# EAGLE design RH040.2 (EAGLE 7.1.0)
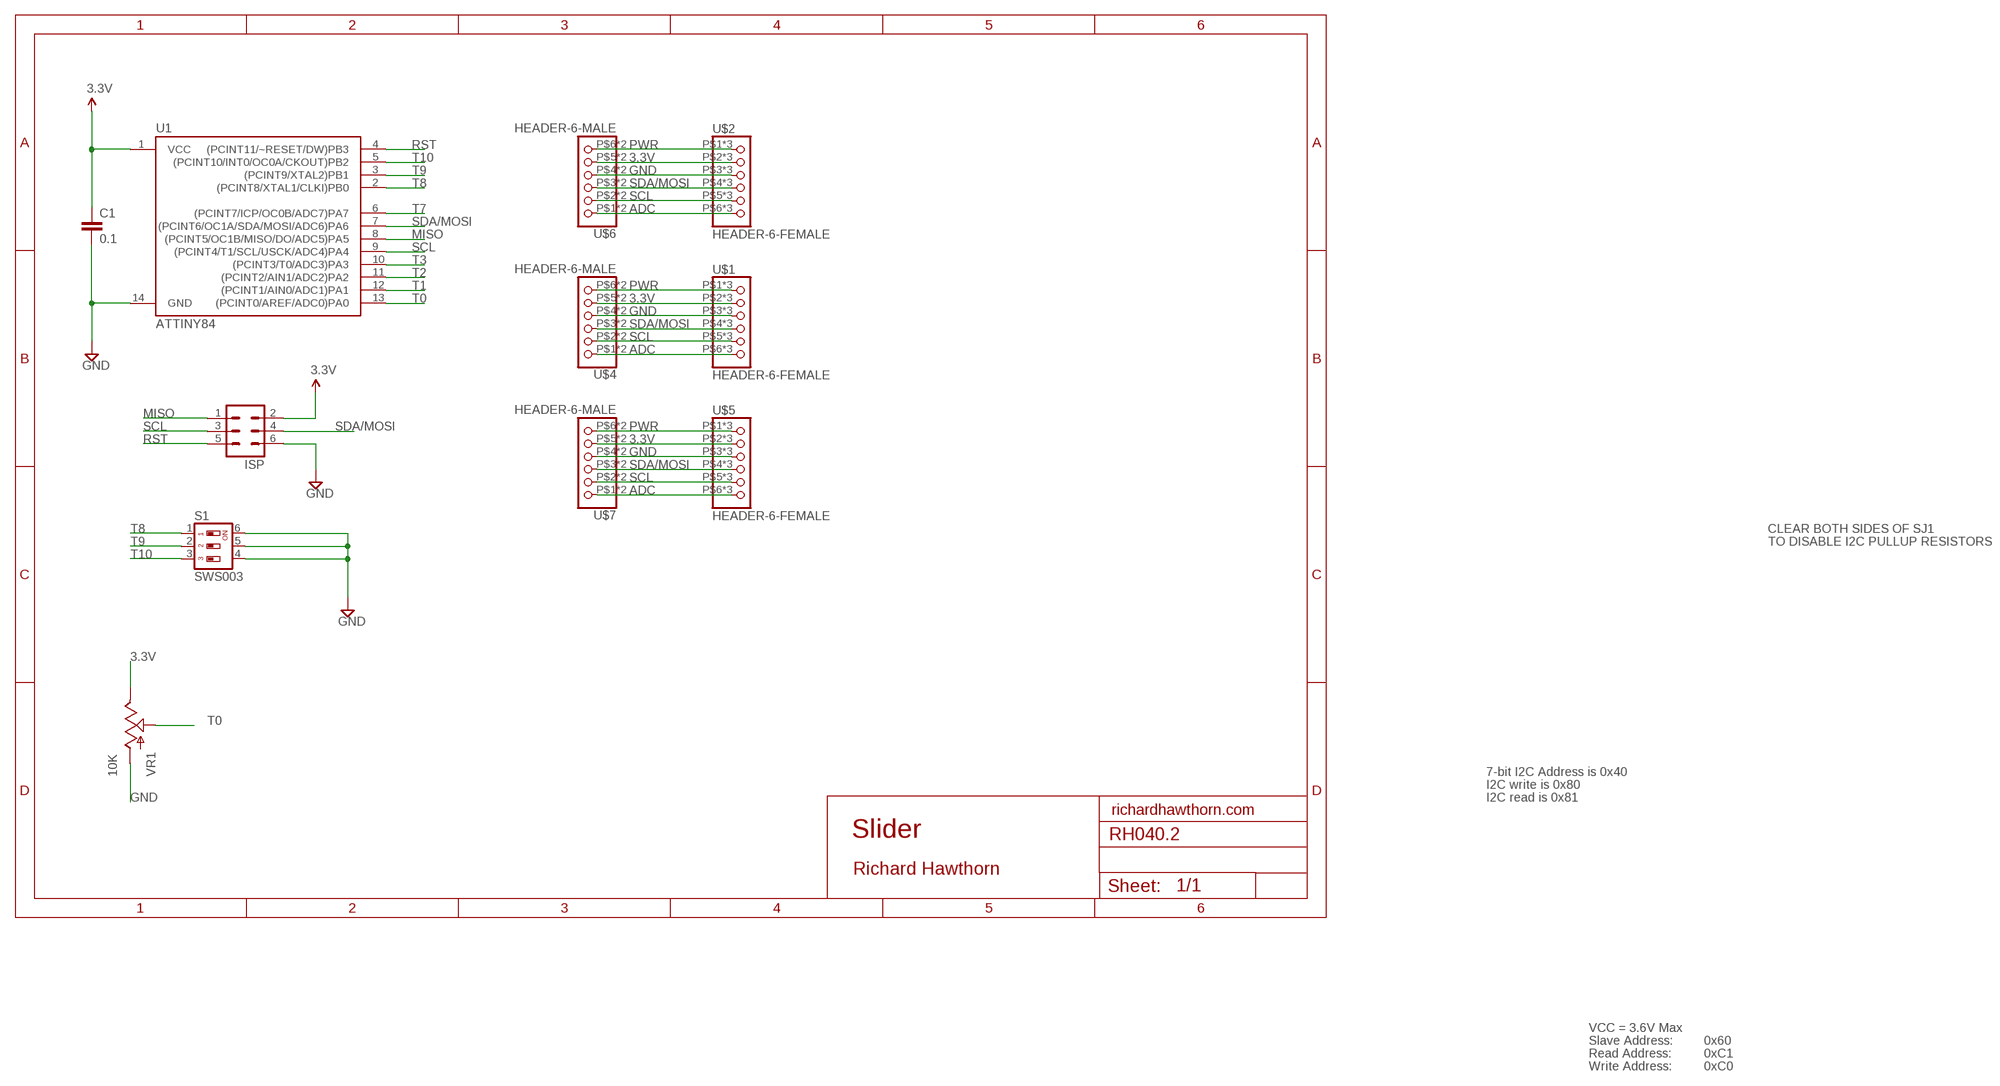
[diagram p0: schematic, sheet 1]

## Parts
C1  0.1  CAP0603-CAP  [0603-CAP]
ISP  MA03-2  [MA03-2]
S1  SWS003  [SMS-003]
U1  ATTINY84  [SO14]
U$1  HEADER-6-FEMALE  [2MMHEADER6]
U$2  HEADER-6-FEMALE  [2MMHEADER6]
U$4  HEADER-6-MALE  [2MMHEADERPIN6]
U$5  HEADER-6-FEMALE  [2MMHEADER6]
U$6  HEADER-6-MALE  [2MMHEADERPIN6]
U$7  HEADER-6-MALE  [2MMHEADERPIN6]
VR1  10K  SLIDER30MM-KIT  [SLIDER-MEDIUM-KIT]

## Nets
3.3V: C1.1 ISP.2 U1.1(VCC) U$1.P$2 U$1.P$10 U$1.P$18 U$2.P$2 U$2.P$10 U$2.P$18 U$4.P$5 U$4.P$13 U$5.P$2 U$5.P$10 U$5.P$18 U$6.P$5 U$6.P$13 U$7.P$5 U$7.P$13 VR1.TOP(E)
ADC: U$1.P$6 U$1.P$14 U$1.P$22 U$2.P$6 U$2.P$14 U$2.P$22 U$4.P$1 U$4.P$9 U$5.P$6 U$5.P$14 U$5.P$22 U$6.P$1 U$6.P$9 U$7.P$1 U$7.P$9
GND [power]: C1.2 ISP.6 S1.4 S1.5 S1.6 U1.14(GND) U$1.P$3 U$1.P$11 U$1.P$19 U$2.P$3 U$2.P$11 U$2.P$19 U$4.P$4 U$4.P$12 U$5.P$3 U$5.P$11 U$5.P$19 U$6.P$4 U$6.P$12 U$7.P$4 U$7.P$12 VR1.BOTTOM(A)
MISO: ISP.1 U1.8((PCINT5/OC1B/MISO/DO/ADC5)PA5)
PWR [power]: U$1.P$1 U$1.P$9 U$1.P$17 U$2.P$1 U$2.P$9 U$2.P$17 U$4.P$6 U$4.P$14 U$5.P$1 U$5.P$9 U$5.P$17 U$6.P$6 U$6.P$14 U$7.P$6 U$7.P$14
RST: ISP.5 U1.4((PCINT11/~RESET/DW)PB3)
SCL: ISP.3 U1.9((PCINT4/T1/SCL/USCK/ADC4)PA4) U$1.P$5 U$1.P$13 U$1.P$21 U$2.P$5 U$2.P$13 U$2.P$21 U$4.P$2 U$4.P$10 U$5.P$5 U$5.P$13 U$5.P$21 U$6.P$2 U$6.P$10 U$7.P$2 U$7.P$10
SDA/MOSI: ISP.4 U1.7((PCINT6/OC1A/SDA/MOSI/ADC6)PA6) U$1.P$4 U$1.P$12 U$1.P$20 U$2.P$4 U$2.P$12 U$2.P$20 U$4.P$3 U$4.P$11 U$5.P$4 U$5.P$12 U$5.P$20 U$6.P$3 U$6.P$11 U$7.P$3 U$7.P$11
T0: U1.13((PCINT0/AREF/ADC0)PA0) VR1.WIPER(S)
T1: U1.12((PCINT1/AIN0/ADC1)PA1)
T2: U1.11((PCINT2/AIN1/ADC2)PA2)
T3: U1.10((PCINT3/T0/ADC3)PA3)
T7: U1.6((PCINT7/ICP/OC0B/ADC7)PA7)
T8: S1.1 U1.2((PCINT8/XTAL1/CLKI)PB0)
T9: S1.2 U1.3((PCINT9/XTAL2)PB1)
T10: S1.3 U1.5((PCINT10/INT0/OC0A/CKOUT)PB2)

## Notes on the sheet
- CLEAR BOTH SIDES OF SJ1
- TO DISABLE I2C PULLUP RESISTORS
- 7-bit I2C Address is 0x40
- I2C write is 0x80
- I2C read is 0x81
- richardhawthorn.com
- Slider
- Richard Hawthorn
- VCC = 3.6V Max
- Slave Address: | 0x60
- Read Address: | 0xC1
- Write Address: | 0xC0

## Library data of the parts
C1 = LowPowerLab:CAP: Capacitor Standard 0603 ceramic capacitor, and 0.1" leaded capacitor.
ISP = Richards:MA03-2: PIN HEADER; OC_FARNELL: unknown; OC_NEWARK: unknown
S1 = smd-special:SWS003: SMD Dip Switch 3 pol.
U1 = SparkFun-DigitalIC:ATTINY84: Atmel 14-pin 2/4/8kB flash uC
U$1 U$2 U$5 = Richards:HEADER-6-FEMALE
U$4 U$6 U$7 = Richards:HEADER-6-MALE
VR1 = SparkFun-Electromechanical:SLIDER: Slide-type potentiometers. Small and meduim footprints untested.; PROD_ID: RES-11931

## Net classes
1 power: width 0.381 mm, clearance 0.254 mm

## Board
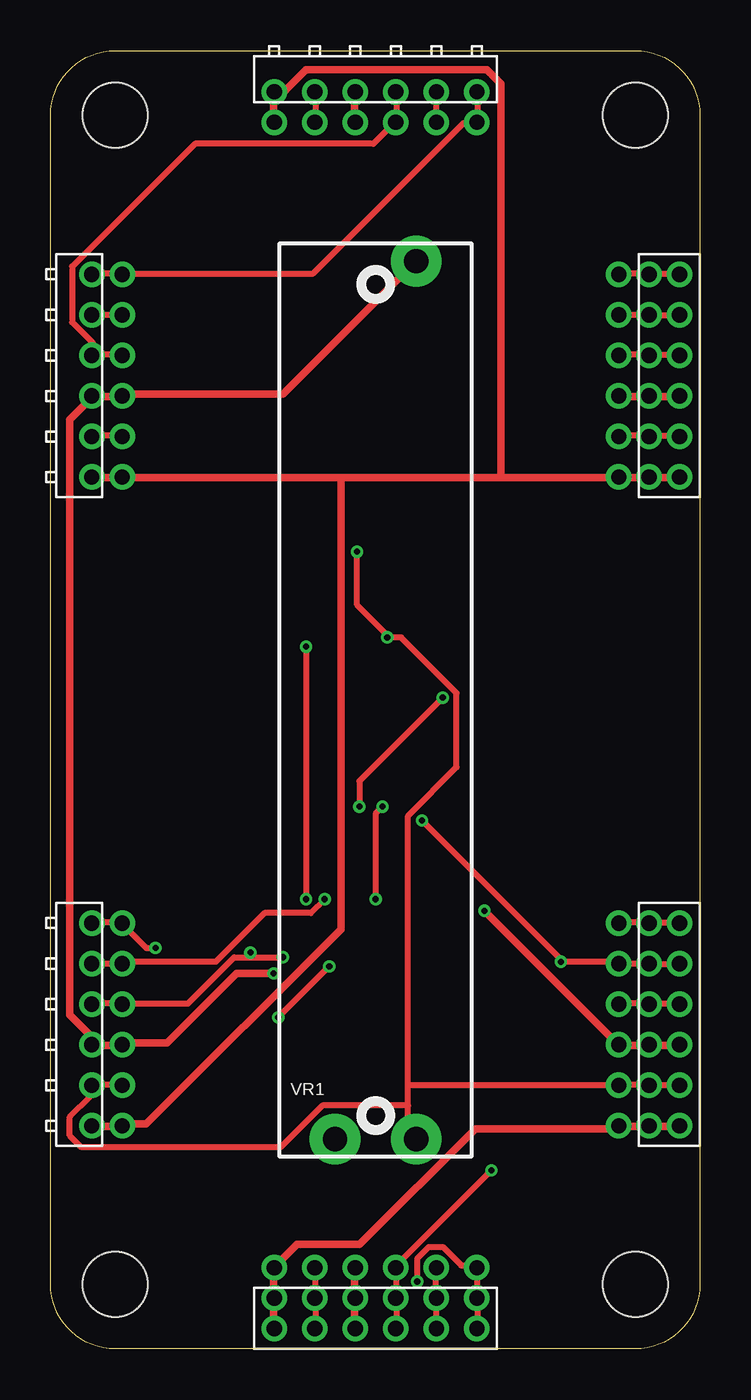
[diagram p1: board, top side]
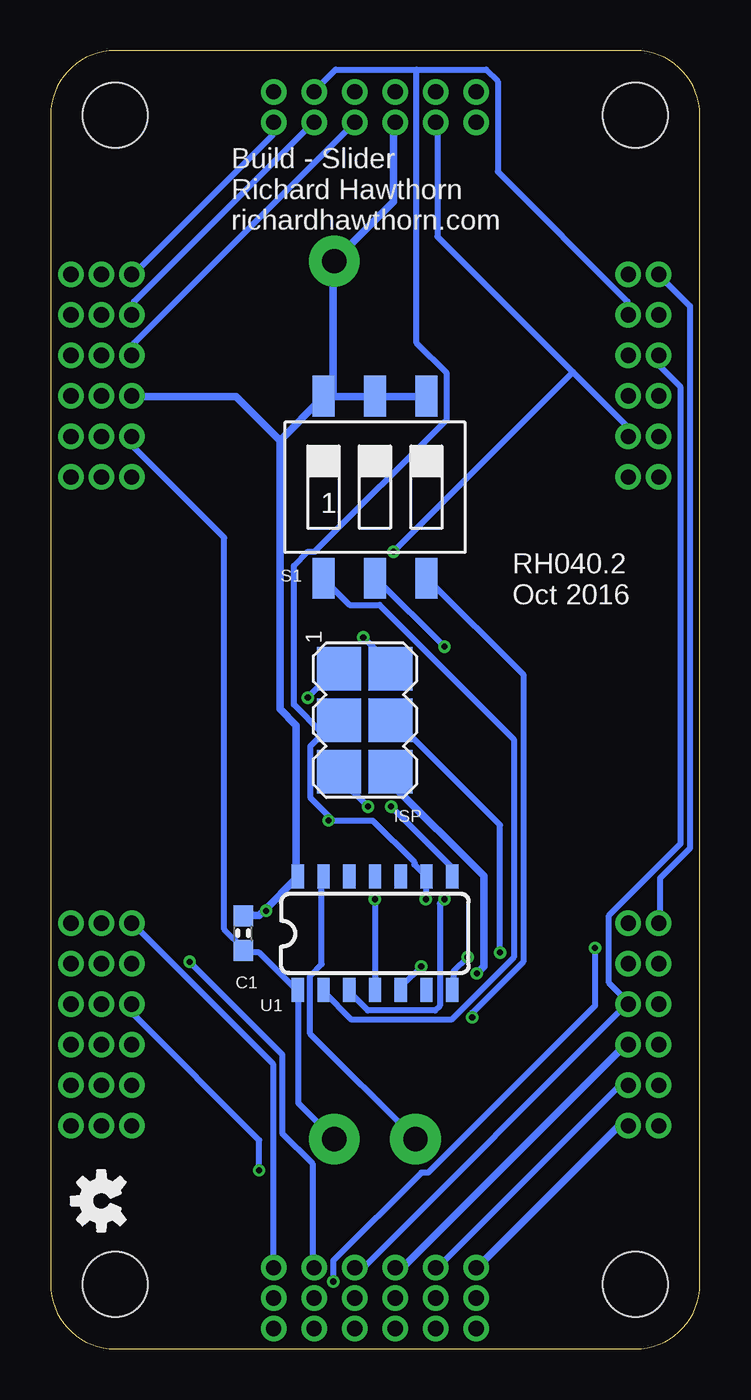
[diagram p2: board, bottom side, seen from below]

Size 32.03 x 64.03 mm. Coordinates in mm from the lower left corner, seen from the top.
Outline: 28.86,0 3.17,0 arc-90 0,3.17 0,60.85 arc-90 3.17,64.03 28.86,64.03 arc-90 32.03,60.85 32.03,3.17 arc-90 28.86,0
Copper layers (1*16): Top 0.035mm / dielectric 1.5mm / Bottom 0.035mm
Design rules "ITEADstudio_DRC *": minimum track width 12mil, minimum drill 12mil, track to track 6mil, track to pad 6mil, pad to pad 6mil, via to via 6mil, smd to smd 0mil, copper to edge 10mil, drill to drill 10mil, minimum pad ring 10mil, minimum via ring 6mil, stop-mask expansion 2mil, vias tented up to drill 100mil, thermal gap 15mil
Holes 3.2 mm at 28.86,3.17 28.86,60.85 3.17,3.17 3.17,60.85
tRestrict: area 26.3,0 to 32,5.7; area 26.3,58.3 to 32,64; area 0,58.3 to 5.7,64; area 0,0 to 5.7,5.7
bRestrict: area 0,0 to 5.7,5.7; area 0,58.3 to 5.7,64; area 26.3,58.3 to 32,64; area 26.3,0 to 32,5.7

### Footprints (pad centres in the part's own frame; a part is rotated, then mirrored left to right if it is on the bottom)
0603-CAP = smd 1.016 x 0.965: 1 -0.85,0; 2 0.85,0
MA03-2 = smd 2.159 x 2.159: 1 -2.54,-1.27; 2 -2.54,1.27; 3 0,-1.27; 4 0,1.27; 5 2.54,-1.27; 6 2.54,1.27
SMS-003 = smd 1.092 x 2.007: 1 -2.54,-4.496; 2 0,-4.496; 3 2.54,-4.496; 4 2.54,4.496; 5 0,4.496; 6 -2.54,4.496
SO14 = smd 0.6 x 1.2: 1 -3.81,-2.8; 2 -2.54,-2.8; 3 -1.27,-2.8; 4 0,-2.8; 5 1.27,-2.8; 6 2.54,-2.8; 7 3.81,-2.8; 8 3.81,2.8; 9 2.54,2.8; 10 1.27,2.8; 11 0,2.8; 12 -1.27,2.8; 13 -2.54,2.8; 14 -3.81,2.8
2MMHEADER6 = drill 0.75: P$1 1,5; P$2 1,3; P$3 1,1; P$4 1,-1; P$5 1,-3; P$6 1,-5; P$9 -0.5,5; P$10 -0.5,3; P$11 -0.5,1; P$12 -0.5,-1; P$13 -0.5,-3; P$14 -0.5,-5; P$17 -2,5; P$18 -2,3; P$19 -2,1; P$20 -2,-1; P$21 -2,-3; P$22 -2,-5
2MMHEADERPIN6 = drill 0.75: P$1 1,5; P$2 1,3; P$3 1,1; P$4 1,-1; P$5 1,-3; P$6 1,-5; P$9 -0.5,5; P$10 -0.5,3; P$11 -0.5,1; P$12 -0.5,-1; P$13 -0.5,-3; P$14 -0.5,-5
SLIDER-MEDIUM-KIT = drill 1.2 pad 2.5: BOTTOM 21.65,-2; TOP -21.65,-2; WIPER -21.65,2

### Placement (x,y rotation side)
C1  22.53,20.5 90 bottom
ISP  16.53,31 270 bottom
S1  16.03,42.5 0 bottom
U1  16.03,20.5 0 bottom
U$1  29.03,16 180 top
U$2  16.03,3 90 top
U$3  [OSHW-LOGO-S]  29.53,7.3 90 bottom
U$4  2.53,48 0 top
U$5  29.03,48 180 top
U$6  2.53,16 0 top
U$7  16.03,61.5 270 top
VR1  16.03,32 90 top

### Tracks (layer width: path | path; a pad name or v marks a point on that pad's centre or on a via)
3.3V  (via drill 0.3)
  Top 0.305: U$4.P$13 2.09,45.03 3.46,45.03 U$4.P$5 | U$7.P$5 13.06,60.58 13.06,61.95 U$7.P$13 | U$6.P$5 3.46,13.03 2.09,13.03 U$6.P$13 1.97,12.92 1.97,12.46 0.94,11.43 0.94,10.52 1.52,9.94 11.35,9.94 13.4,12 17.63,12 | U$2.P$18 13.06,1.03 13.06,2.4 U$2.P$10 13.06,2.63 13.06,3.89 U$2.P$2 | U$5.P$2 28.03,45.03 29.52,45.03 U$5.P$10 29.63,45.03 31.01,45.03 U$5.P$18 | U$1.P$18 31.01,13.03 29.63,13.03 U$1.P$10 29.52,13.03 28.03,13.03 U$1.P$2 27.92,13.03 17.63,13.03 | 17.63,12 17.63,10.74 17.98,10.4 VR1.TOP | 17.63,12 17.63,13.03 | 17.63,13.03 17.63,26.29 20.03,28.69 20.03,32.35 17.29,35.09 v16.6,35.09 16.6,35.2 15.12,36.69 v15.12,39.32
  Bottom 0.305: 6.26,48.18 12.95,54.86 12.95,60.47 U$7.P$5 | 6.26,48.18 3.57,45.49 3.57,45.03 U$4.P$5 | U$6.P$5 3.57,12.92 4.03,12.92 12.95,4 U$2.P$2 | v16.6,35.09 15.35,33.83 15.35,33.6 ISP.2 | VR1.TOP 18.09,10.4 19.8,12.12 19.8,17.6 U1.1 19.92,17.72 21.75,19.55 22.43,19.55 C1.1 22.55,19.77 23.46,20.69 23.46,40.01 27.92,44.46 27.92,44.92 U$5.P$2 | v15.12,39.32 6.26,48.18
ADC  (via drill 0.3)
  Top 0.305: U$2.P$22 21.06,1.03 21.06,2.4 U$2.P$14 21.06,2.63 21.06,3.89 U$2.P$6 20.95,4.12 20.26,4.12 19.35,5.03 18.66,5.03 18.09,4.46 v18.09,3.31 | U$1.P$6 28.03,21.03 29.52,21.03 U$1.P$14 29.63,21.03 31.01,21.03 U$1.P$22 | U$7.P$9 21.06,61.95 21.06,60.58 U$7.P$1 20.95,60.47 20.38,60.47 12.95,53.03 3.57,53.03 U$4.P$1 3.46,53.03 2.09,53.03 U$4.P$9 | U$5.P$6 28.03,53.03 29.52,53.03 U$5.P$14 29.63,53.03 31.01,53.03 U$5.P$22 | U$6.P$9 2.09,21.03 3.46,21.03 U$6.P$1 3.57,20.92 4.72,19.77 v5.17,19.77
  Bottom 0.305: U$2.P$6 21.06,4 21.06,14.06 27.92,20.92 U$1.P$6 | U$7.P$1 21.06,60.47 21.06,59.89 27.92,53.03 U$5.P$6 | U$6.P$9 1.97,21.03 1.97,23.2 0.49,24.69 0.49,51.44 1.97,52.92 U$4.P$9 | v18.09,3.31 18.09,4.34 13.75,8.69 13.4,8.69 5.17,16.92 v5.17,19.77
GND  (via drill 0.3)
  Top 0.381: U$2.P$19 15,1.03 15,2.4 U$2.P$11 15,2.63 15,3.89 U$2.P$3 | v11,18.52 9.17,18.52 5.75,15.09 3.57,15.09 U$6.P$4 3.34,14.97 2.09,14.97 U$6.P$12 1.97,15.09 1.97,15.43 0.94,16.46 0.94,45.83 1.97,46.86 U$4.P$12 2.09,46.98 3.46,46.98 U$4.P$4 3.69,47.09 11.46,47.09 17.98,53.61 VR1.BOTTOM | U$7.P$4 15,60.58 15,61.95 U$7.P$12 | U$5.P$3 28.03,46.98 29.52,46.98 U$5.P$11 29.63,46.98 31.01,46.98 U$5.P$19 | U$1.P$19 31.01,14.97 29.63,14.97 U$1.P$11 29.52,14.97 28.03,14.97 U$1.P$3 27.92,15.09 v21.4,21.6
  Bottom 0.381: v11,18.52 10.66,18.86 10.66,23.32 15.23,27.89 15.23,28.35 ISP.6 | U$2.P$3 15,4 14.66,4 3.57,15.09 U$6.P$4 | U$7.P$4 15.12,60.47 15.12,56.58 17.98,53.72 VR1.BOTTOM 18.09,53.49 18.09,47.09 S1.6 | 21.46,21.66 19.92,23.2 U1.14 19.92,23.43 19.92,30.75 20.72,31.55 20.72,44.81 | 21.46,21.66 21.75,21.37 22.43,21.37 C1.2 | S1.4 13.52,46.98 15.92,46.98 S1.5 16.15,46.98 18.55,46.98 S1.6 | 20.72,44.81 18.66,46.86 S1.6 | v21.4,21.6 21.46,21.66 | 20.72,44.81 22.89,46.98 27.92,46.98 U$5.P$3
MISO  (via drill 0.3)
  Top 0.305: v15.23,26.75 15.23,28 v19.35,32.12
  Bottom 0.305: v15.23,26.75 12.26,23.77 12.26,23.32 U1.8 | v19.35,32.12 17.86,33.6 ISP.1
PWR
  Top 0.381: U$1.P$17 31.01,10.97 29.63,10.97 U$1.P$9 29.52,10.97 28.03,10.97 U$1.P$1 27.92,10.86 20.95,10.86 15.23,5.14 12.15,5.14 11.12,4.12 U$2.P$1 11,3.89 11,2.63 U$2.P$9 11,2.4 11,1.03 U$2.P$17 | U$6.P$14 2.09,10.97 3.46,10.97 U$6.P$6 3.69,11.09 4.72,11.09 14.32,20.69 14.32,42.98 | U$7.P$6 11,60.58 11,61.95 U$7.P$14 11.12,62.06 11.57,62.06 12.6,63.09 21.52,63.09 22.2,62.41 22.2,42.98 | U$4.P$14 2.09,42.98 3.46,42.98 U$4.P$6 3.69,42.98 14.32,42.98 | U$5.P$17 31.01,42.98 29.63,42.98 U$5.P$9 29.52,42.98 28.03,42.98 U$5.P$1 27.92,42.98 22.2,42.98 | 22.2,42.98 14.32,42.98
  Bottom 0.381: U$6.P$6 3.57,10.97 4.03,10.97 11,4 U$2.P$1
RST  (via drill 0.3)
  Top 0.305: v16.03,22.17 16.03,26.4 v16.38,26.75
  Bottom 0.305: v16.03,22.17 16.03,17.72 U1.4 | v16.38,26.75 17.75,28.12 17.75,28.35 ISP.5
SCL  (via drill 0.3)
  Top 0.305: U$5.P$5 28.03,50.98 29.52,50.98 U$5.P$13 29.63,50.98 31.01,50.98 U$5.P$21 | U$4.P$10 2.09,50.98 3.46,50.98 U$4.P$2 | U$7.P$2 19,60.58 19,61.95 U$7.P$10 | U$6.P$10 2.09,18.97 3.46,18.97 U$6.P$2 3.57,19.09 8.14,19.09 10.55,21.49 12.83,21.49 v13.52,22.17 | U$2.P$21 19,1.03 19,2.4 U$2.P$13 19,2.63 19,3.89 U$2.P$5 | U$1.P$21 31.01,18.97 29.63,18.97 U$1.P$13 29.52,18.97 28.03,18.97 U$1.P$5 27.92,19.09 v25.18,19.09 25.18,19.2 v18.32,26.06
  Bottom 0.305: 13.97,63.09 17.98,63.09 19,62.06 U$7.P$10 | 13.97,63.09 10.55,63.09 9.97,62.52 9.97,58.06 3.57,51.66 3.57,51.09 U$4.P$2 | U$5.P$5 27.92,51.09 27.92,51.66 19.12,60.47 U$7.P$2 | 18.09,26.06 16.15,26.06 14.09,24 14.09,23.89 13.52,23.32 U1.9 13.52,23.2 v13.52,22.17 | 18.09,26.06 19.23,27.2 19.23,29.72 17.86,31.09 ISP.3 18.66,30.4 20.03,31.77 20.03,38.63 19.35,39.32 19,39.32 12.49,45.83 12.49,48.12 13.97,49.61 13.97,63.09 | v25.18,19.09 20.6,14.52 20.6,10.63 19.12,9.14 19.12,4 U$2.P$5 | v18.32,26.06 18.09,26.06
SDA/MOSI  (via drill 0.3)
  Top 0.305: U$5.P$4 28.03,49.03 29.52,49.03 U$5.P$12 29.63,49.03 31.01,49.03 U$5.P$20 | U$4.P$3 3.46,49.03 2.09,49.03 U$4.P$11 2.09,49.15 2.09,49.61 1.06,50.63 1.06,53.38 7.12,59.44 15.92,59.44 16.95,60.47 U$7.P$3 17.06,60.58 17.06,61.95 U$7.P$11 | U$1.P$4 28.03,17.03 29.52,17.03 U$1.P$12 29.63,17.03 31.01,17.03 U$1.P$20 | U$2.P$20 17.06,1.03 17.06,2.4 U$2.P$12 17.06,2.63 17.06,3.89 U$2.P$4 17.06,4.12 v21.75,8.8 | 9.86,19.32 9.06,19.32 6.77,17.03 3.57,17.03 U$6.P$3 3.46,17.03 2.09,17.03 U$6.P$11 | 9.86,19.32 v11.46,19.32 | v9.86,19.55 9.86,19.32
  Bottom 0.305: U$5.P$4 27.92,49.03 27.92,49.61 17.06,60.47 U$7.P$3 | v11.46,19.32 12.15,18.63 12.15,17.72 U1.7 | v9.86,19.55 9.86,25.83 15,30.98 15.23,30.98 ISP.4 | U$2.P$4 16.95,4 16.6,4 3.57,17.03 U$6.P$3 3.57,17.14 4.49,18.06 4.49,21.37 0.94,24.92 0.94,47.43 1.97,48.46 1.97,48.92 U$4.P$11 | v21.75,8.8 21.75,10.29 27.92,16.46 27.92,16.92 U$1.P$4
T0
  Bottom 0.305: U1.13 18.66,23.2 18.66,18.97 19.23,18.4 19.23,15.54 14.09,10.4 VR1.WIPER
T8
  Bottom 0.305: U1.2 18.55,17.6 17.18,16.23 12.26,16.23 9.17,19.32 9.17,30.06 15.8,36.69 17.29,36.69 18.55,37.95 S1.1
T9  (via drill 0.3)
  Top 0.305: v12.6,34.63 v12.6,22.17
  Bottom 0.305: v12.6,22.17 12.83,21.95 12.83,16.92 13.06,16.69 16.38,16.69 17.29,17.6 U1.3 | v12.6,34.63 15.92,37.95 S1.2
T10  (via drill 0.3)
  Top 0.305: v11.23,16.34 v13.75,18.86
  Bottom 0.305: v13.75,18.86 14.66,17.95 14.66,17.72 U1.5 | v11.23,16.34 11.23,16.57 8.72,19.09 8.72,33.26 13.4,37.95 S1.3

### Text on the board
bPlace: Build - Slider / Richard Hawthorn / richardhawthorn.com | RH040.2 / Oct 2016
tDocu: REG